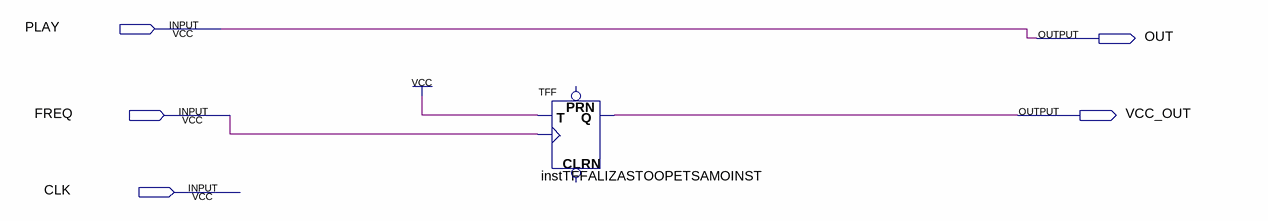
[diagram p0: schematic sheet]
// Quartus schematic zujalica.bdf as structural Verilog: 1 symbols, 5 pins
module zujalica (
  input  PLAY,
  input  FREQ,
  input  CLK,
  output OUT,
  output VCC_OUT
);

  TFF instTFFALIZASTOOPETSAMOINST (.T(1'b1), .CLK(FREQ), .Q(VCC_OUT));  // open: PRN, CLRN

  assign OUT = PLAY;
endmodule
